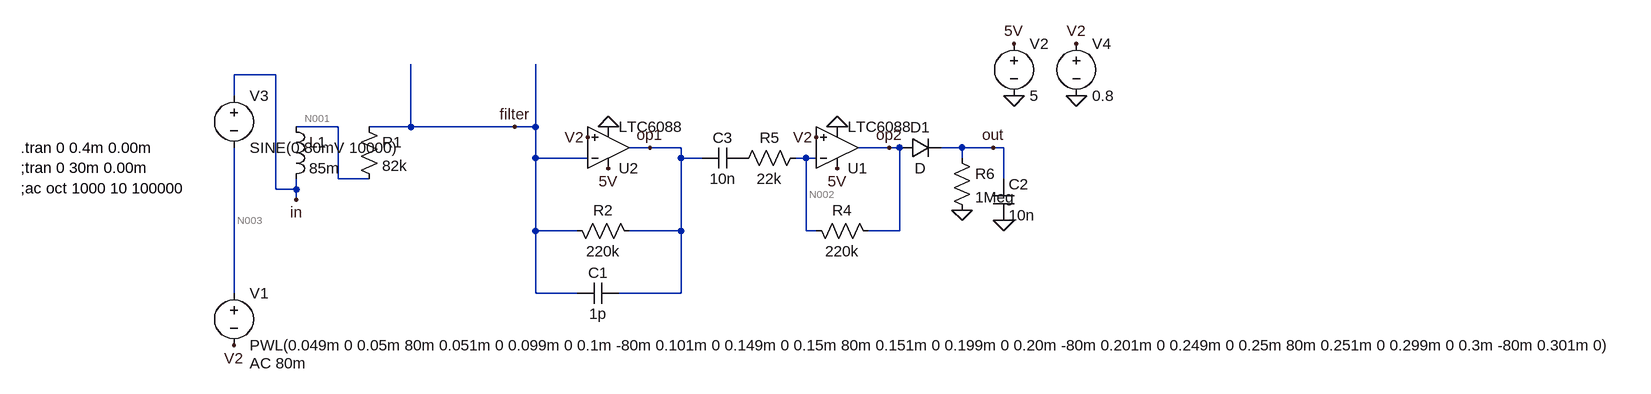
[diagram p0: schematic pw_my.asc]
pw_my.asc, the LTspice schematic file:
Version 4
SHEET 1 2056 680
WIRE -16 -48 -80 -48
WIRE -80 -16 -80 -48
WIRE 80 32 16 32
WIRE 192 32 192 -64
WIRE 192 32 128 32
WIRE 352 32 192 32
WIRE 384 32 384 -64
WIRE 384 32 352 32
WIRE 560 64 528 64
WIRE 608 64 560 64
WIRE 928 64 880 64
WIRE 944 64 928 64
WIRE 1040 64 1008 64
WIRE 1088 64 1040 64
WIRE 1104 64 1088 64
WIRE 384 80 384 32
WIRE 464 80 384 80
WIRE 608 80 608 64
WIRE 640 80 608 80
WIRE 800 80 784 80
WIRE 816 80 800 80
WIRE 1040 80 1040 64
WIRE 80 112 80 32
WIRE 128 112 80 112
WIRE 1104 112 1104 64
WIRE -16 128 -16 -48
WIRE 16 128 16 112
WIRE 16 128 -16 128
WIRE 16 144 16 128
WIRE 384 192 384 80
WIRE 448 192 384 192
WIRE 608 192 608 80
WIRE 608 192 528 192
WIRE 800 192 800 80
WIRE 816 192 800 192
WIRE 944 192 944 64
WIRE 944 192 896 192
WIRE -80 288 -80 64
WIRE 384 288 384 192
WIRE 448 288 384 288
WIRE 608 288 608 192
WIRE 608 288 512 288
FLAG 16 144 in
FLAG 352 32 filter
FLAG 560 64 op1
FLAG 496 32 0
FLAG 496 96 5V
FLAG 1120 -16 0
FLAG 1120 -96 5V
FLAG 1216 -16 0
FLAG 1216 -96 V2
FLAG -80 368 V2
FLAG 848 32 0
FLAG 848 96 5V
FLAG 928 64 op2
FLAG 1104 176 0
FLAG 1040 160 0
FLAG 1088 64 out
FLAG 464 48 V2
FLAG 816 48 V2
SYMBOL ind 0 16 R0
SYMATTR InstName L1
SYMATTR Value 85m
SYMBOL res 112 16 R0
SYMATTR InstName R1
SYMATTR Value 82k
SYMBOL cap 512 272 R90
WINDOW 0 0 32 VBottom 2
WINDOW 3 32 32 VTop 2
SYMATTR InstName C1
SYMATTR Value 1p
SYMBOL voltage -80 272 R0
WINDOW 123 24 124 Left 2
WINDOW 39 0 0 Left 0
SYMATTR Value2 AC 80m
SYMATTR InstName V1
SYMATTR Value PWL(0.049m 0 0.05m 80m 0.051m 0 0.099m 0 0.1m -80m 0.101m 0 0.149m 0 0.15m 80m 0.151m 0 0.199m 0 0.20m -80m 0.201m 0 0.249m 0 0.25m 80m 0.251m 0 0.299m 0 0.3m -80m 0.301m 0)
SYMBOL voltage -80 -32 R0
WINDOW 123 0 0 Left 0
WINDOW 39 0 0 Left 0
SYMATTR InstName V3
SYMATTR Value SINE(0 80mV 10000)
SYMBOL res 544 208 M270
WINDOW 0 32 56 VTop 2
WINDOW 3 0 56 VBottom 2
SYMATTR InstName R2
SYMATTR Value 220k
SYMBOL Opamps\\LTC6088 496 64 M180
SYMATTR InstName U2
SYMBOL voltage 1120 -112 R0
WINDOW 123 0 0 Left 0
WINDOW 39 0 0 Left 0
SYMATTR InstName V2
SYMATTR Value 5
SYMBOL voltage 1216 -112 R0
WINDOW 123 0 0 Left 0
WINDOW 39 0 0 Left 0
SYMATTR InstName V4
SYMATTR Value 0.8
SYMBOL Opamps\\LTC6088 848 64 M180
SYMATTR InstName U1
SYMBOL res 912 208 M270
WINDOW 0 32 56 VTop 2
WINDOW 3 0 56 VBottom 2
SYMATTR InstName R4
SYMATTR Value 220k
SYMBOL res 800 64 R90
WINDOW 0 0 56 VBottom 2
WINDOW 3 32 56 VTop 2
SYMATTR InstName R5
SYMATTR Value 22k
SYMBOL diode 944 80 R270
WINDOW 0 32 32 VTop 2
WINDOW 3 0 32 VBottom 2
SYMATTR InstName D1
SYMBOL cap 1088 112 R0
SYMATTR InstName C2
SYMATTR Value 10n
SYMBOL res 1024 64 R0
SYMATTR InstName R6
SYMATTR Value 1Meg
SYMBOL cap 704 64 R90
WINDOW 0 0 32 VBottom 2
WINDOW 3 32 32 VTop 2
SYMATTR InstName C3
SYMATTR Value 10n
TEXT -408 64 Left 2 !.tran 0 0.4m 0.00m\n;tran 0 30m 0.00m\n;ac oct 1000 10 100000

The netlist it stands for:
* pw_my.asc
L1 N001 in 85m
R1 filter N001 82k
C1 op1 filter 1p
V1 N003 V2 PWL(0.049m 0 0.05m 80m 0.051m 0 0.099m 0 0.1m -80m 0.101m 0 0.149m 0 0.15m 80m 0.151m 0 0.199m 0 0.20m -80m 0.201m 0 0.249m 0 0.25m 80m 0.251m 0 0.299m 0 0.3m -80m 0.301m 0) AC 80m
V3 in N003 SINE(0 80mV 10000)
R2 op1 filter 220k
* U2: LTC6088 (symbol Opamps\LTC6088 not available, pins judged from their places): In+=V2 In-=filter V+=5V V-=0 OUT=op1
V2 5V 0 5
V4 V2 0 0.8
* U1: LTC6088 (symbol Opamps\LTC6088 not available, pins judged from their places): In+=V2 In-=N002 V+=5V V-=0 OUT=op2
R4 op2 N002 220k
R5 N002 P001 22k
D1 op2 out D
C2 out 0 10n
R6 out 0 1Meg
C3 P001 op1 10n
.model D D
.lib standard.dio
.tran 0 0.4m 0.00m
;tran 0 30m 0.00m
;ac oct 1000 10 100000
.backanno
.end

* Results of the author's LTspice run, read from the files saved beside the schematic
* Operating Point, zero values left out:
*   V(n001) = 800 mV
*   V(in) = 800 mV
*   V(filter) = 800 mV
*   V(op1) = 800 mV
*   V(n003) = 800 mV
*   V(v2) = 800 mV
*   V(5v) = 5 V
*   V(op2) = 800 mV
*   V(n002) = 800 mV
*   V(p001) = 800 mV
*   V(out) = 350.7 mV
*   I(D1) = 350.7 nA
*   I(L1) = 5.551 pA
*   I(R6) = 350.7 nA
*   I(R4) = -2.62 pA
*   I(R2) = 2.975 pA
*   I(R1) = 5.595 pA
*   I(V4) = 10.81 pA
*   I(V2) = -2.098 mA
*   I(V3) = 5.571 pA
*   I(V1) = 5.571 pA
*   Ix(u2:1) = -2.62 pA
*   Ix(u2:2) = -2.62 pA
*   Ix(u2:3) = 1.049 mA
*   Ix(u2:4) = -1.049 mA
*   Ix(u1:1) = -2.62 pA
*   Ix(u1:2) = -2.62 pA
*   Ix(u1:3) = 1.049 mA
*   Ix(u1:4) = -1.049 mA
*   Ix(u1:5) = -350.6 nA